# Altium project OPG_control_unit.PrjPcb
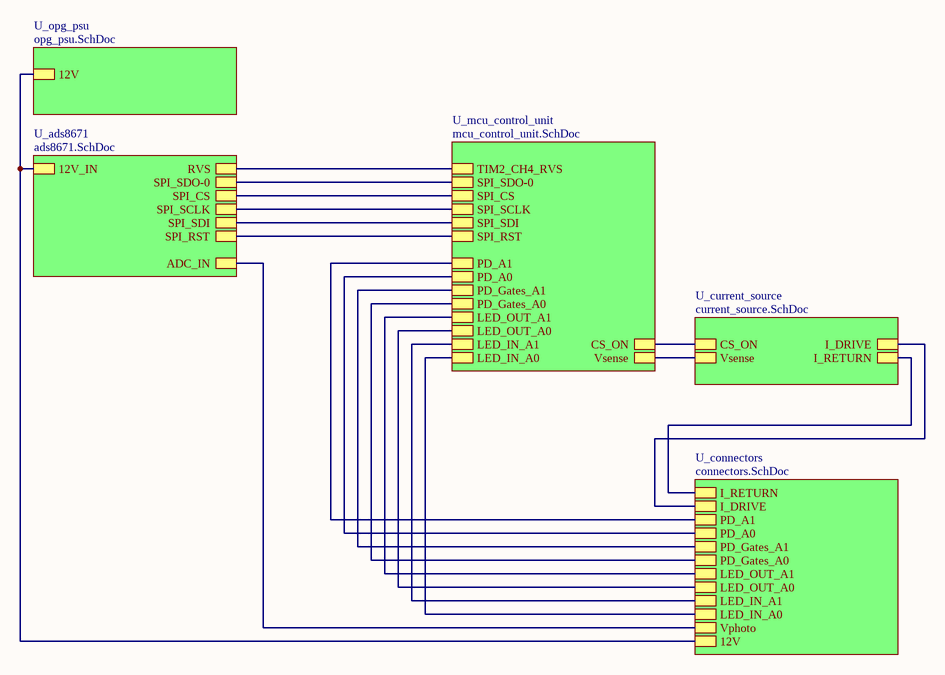
[diagram p0: top_sheet.SchDoc]
5 sheets, 67 parts. Net scope: hierarchical (ports join the sheet entries above them; power ports are global).
Board file: opg_control_unit_pcb.PcbDoc
Sheets:
  top_sheet.SchDoc
    U_current_source = current_source.SchDoc
    U_opg_psu = opg_psu.SchDoc
    U_connectors = connectors.SchDoc
    U_mcu_control_unit = mcu_control_unit.SchDoc

## Sheet top_sheet.SchDoc
size A4; SheetNumber: 1; SheetTotal: 6

### Sub-sheets
U_ads8671 = ads8671.SchDoc (file not in this document): SPI_SDO-0, SPI_SCLK, SPI_CS, SPI_SDI, SPI_RST, 12V_IN, RVS, ADC_IN
U_connectors = connectors.SchDoc: I_RETURN, I_DRIVE, PD_A1, PD_Gates_A1, PD_Gates_A0, LED_OUT_A1, LED_OUT_A0, LED_IN_A1, LED_IN_A0, PD_A0, 12V, Vphoto
U_current_source = current_source.SchDoc: I_DRIVE, I_RETURN, CS_ON, Vsense
U_mcu_control_unit = mcu_control_unit.SchDoc: SPI_SDO-0, SPI_CS, SPI_SCLK, SPI_SDI, SPI_RST, CS_ON, PD_A1, PD_A0, PD_Gates_A1, PD_Gates_A0, LED_OUT_A1, LED_OUT_A0, LED_IN_A1, LED_IN_A0, Vsense, TIM2_CH4_RVS
U_opg_psu = opg_psu.SchDoc: 12V

### Nets
FB: sheet U_current_source/I_RETURN, sheet U_connectors/I_RETURN
NRST: sheet U_ads8671/SPI_RST, sheet U_mcu_control_unit/SPI_RST
NetCSdiv_top_1: sheet U_current_source/CS_ON, sheet U_mcu_control_unit/CS_ON
NetJ2_1: sheet U_ads8671/ADC_IN, sheet U_connectors/Vphoto
NetJ2_3: sheet U_ads8671/12V_IN, sheet U_opg_psu/12V, sheet U_connectors/12V
NetJ2_4: sheet U_connectors/PD_A1, sheet U_mcu_control_unit/PD_A1
NetJ2_5: sheet U_connectors/PD_A0, sheet U_mcu_control_unit/PD_A0
NetJ2_6: sheet U_connectors/PD_Gates_A1, sheet U_mcu_control_unit/PD_Gates_A1
NetJ2_7: sheet U_connectors/PD_Gates_A0, sheet U_mcu_control_unit/PD_Gates_A0
NetJ2_8: sheet U_connectors/LED_OUT_A1, sheet U_mcu_control_unit/LED_OUT_A1
NetJ2_9: sheet U_connectors/LED_OUT_A0, sheet U_mcu_control_unit/LED_OUT_A0
NetJ2_10: sheet U_connectors/LED_IN_A1, sheet U_mcu_control_unit/LED_IN_A1
NetJ2_11: sheet U_connectors/LED_IN_A0, sheet U_mcu_control_unit/LED_IN_A0
NetJ2_13: sheet U_current_source/I_DRIVE, sheet U_connectors/I_DRIVE
NetSEN_1: sheet U_current_source/Vsense, sheet U_mcu_control_unit/Vsense
NetU1_13: sheet U_ads8671/RVS, sheet U_mcu_control_unit/TIM2_CH4_RVS
NetU1_14: sheet U_ads8671/SPI_CS, sheet U_mcu_control_unit/SPI_CS
NetU1_15: sheet U_ads8671/SPI_SCLK, sheet U_mcu_control_unit/SPI_SCLK
NetU1_16: sheet U_ads8671/SPI_SDO-0, sheet U_mcu_control_unit/SPI_SDO-0
NetU1_17: sheet U_ads8671/SPI_SDI, sheet U_mcu_control_unit/SPI_SDI

## Sheet current_source.SchDoc
size A4; SheetNumber: 3; SheetTotal: 6
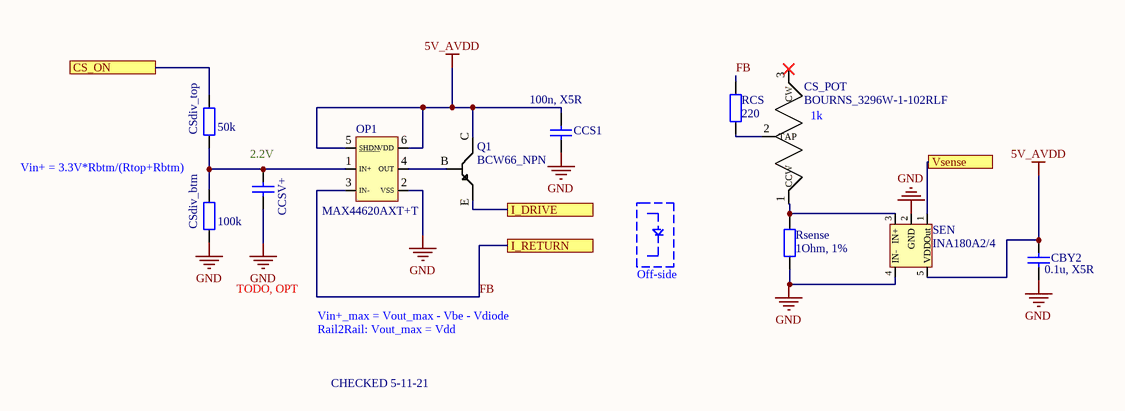
[diagram p1: current_source.SchDoc]

### Parts
CBY2  value 0.1u, X5R  [1608[0603]]
CCS1  value 100n, X5R  [1608[0603]]
CCSV+  value TODO, OPT  [1608[0603]]
CS_POT  BOURNS_3296W-1-102RLF  [BOURNS_3296W-1]
CSdiv_btm  100k  [WRIS-KSKE_0805]
CSdiv_top  50k  [WRIS-KSKE_0805]
OP1  MAX44620AXT+T  [MAX44260_ATX+T]
Q1  BCW66_NPN  [BCW66_NPN]
RCS  220  [WRIS-KSKE_0805]
Rsense  1Ohm, 1%  [WRIS-KSKE_0603]
SEN  INA180A2/4  [INA180Ax]

### Ports
CS_ON, I_DRIVE, I_RETURN, Vsense

### Nets
5V_AVDD: CBY2.1 CCS1.2 OP1.5(SHDN) OP1.6(VDD) Q1.C SEN.5(VDD)
GND: CBY2.2 CCS1.1 CCSV+.2 CSdiv_btm.2 OP1.2(VSS) Rsense.1 SEN.2(GND) SEN.4(IN-)
FB: OP1.3(IN-) RCS.1 ; port I_RETURN
NetCCSV+_1: CCSV+.1 CSdiv_btm.1 CSdiv_top.2 OP1.1(IN+)
NetCS_POT_1: CS_POT.1(CCW) Rsense.2 SEN.3(IN+)
NetCS_POT_2: CS_POT.2(TAP) RCS.2
NetCSdiv_top_1: CSdiv_top.1 ; port CS_ON
NetJ2_13: Q1.E ; port I_DRIVE
NetOP1_4: OP1.4(OUT) Q1.B
NetSEN_1: SEN.1(Out) ; port Vsense

Not connected (* = marked no-connect by the designer): CS_POT 3(CW)*

### Notes on the sheet
- Vin+ = 3.3V*Rbtm/(Rtop+Rbtm)
- (near CCSV+) 2.2V
- (near CS_POT) 1k
- Off-side
- Vin+_max = Vout_max - Vbe - Vdiode
- Rail2Rail: Vout_max = Vdd
- CHECKED 5-11-21

### Library data of the parts
CBY2 CCS1 CCSV+ = Cap Semi: Capacitor (Semiconductor SIM Model); Published: 8-Jun-2000; LatestRevisionDate: 29-May-2009; LatestRevisionNote: IPC-7351 Footprint Added.; PackageReference: C1206; Publisher: Altium Limited; PackageDescription: Chip Capacitor
CS_POT = BOURNS_3296W-1-104RLF: Vertical Potentiometer, multi-turn, 10%
CSdiv_btm CSdiv_top RCS = 560050320001: WRIS-KSKE SMT Thick Film Resistor, size 0805, 0.1Ohm, 0.33W; Manufacturer: Wurth Elektronik; Rated Current: 1.81A; Temperature Coefficient of Resistance: 250ppm/degC; Technical Reference: KE0805R100F103LAATP0000; Resistance Tolerance: +/-1%; ComponentLink1Description: Manufacturer; ComponentLink1URL: http://www.we-online.de; ComponentLink2Description: Datasheet; ComponentLink2URL: https://www.we-online.com/catalog/datasheet/560050320001.pdf; Published Date: May 2020; Rated Power: 0.33W; Resistance: 0.1Ohm; Height: 0.6mm; Operating Temperature: -55 to +155degC; Mounting Technology: SMT; Packaging: Tape and Reel; Size: 0805; Length: 2mm; Manufacturer Part Number: 560050320001; Width: 1.25mm
OP1 = MAX44620AXT+T: Operationsverstärker 1.8V, 15MHz Low-Offs et, Low-Power, Rail
Rsense = 560050316001: WRIS-KSKE SMT Thick Film Resistor, size 0603, 0.1Ohm, 0.25W; Manufacturer: Wurth Elektronik; Rated Current: 1.58A; Temperature Coefficient of Resistance: 250ppm/degC; Technical Reference: KE0603R100F104LAATP0000; Resistance Tolerance: +/-1%; ComponentLink1Description: Manufacturer; ComponentLink1URL: http://www.we-online.de; ComponentLink2Description: Datasheet; ComponentLink2URL: https://www.we-online.com/catalog/datasheet/560050316001.pdf; Published Date: May 2020; Rated Power: 0.25W; Resistance: 0.1Ohm; Height: 0.45mm; Operating Temperature: -55 to +155degC; Mounting Technology: SMT; Packaging: Tape and Reel; Size: 0603; Length: 1.6mm; Manufacturer Part Number: 560050316001; Width: 0.8mm
SEN = INA180Ax: INA180Ax Low- and High-SideVoltageOutput,Current-SenseAmplifiers

## Sheet opg_psu.SchDoc
size A4; SheetNumber: 4; SheetTotal: 6
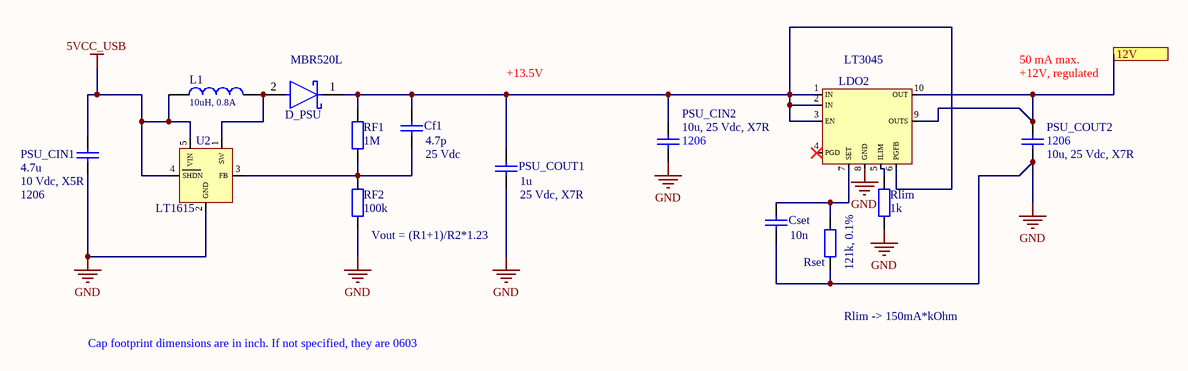
[diagram p2: opg_psu.SchDoc]

### Parts
Cf1  value 4.7p  [1608[0603]]
Cset  value 10n  [1608[0603]]
D_PSU  MBR0540T1G  [On_Semiconductor_425-04_MFG]  (value not drawn)
L1  10uH, 0.8A  [WE-PD2_3521]
LDO2  LT3045  [LT3045]
PSU_CIN1  value 4.7u  [C1206]
PSU_CIN2  value 10u, 25 Vdc, X7R  [C1206]
PSU_COUT1  value 1u  [1608[0603]]
PSU_COUT2  value 10u, 25 Vdc, X7R  [C1206]
RF1  1M  [WRIS-KSKE_0805]
RF2  100k  [WRIS-KSKE_0805]
Rlim  1k  [WRIS-KSKE_0805]
Rset  121k, 0.1%  [WRIS-KSKE_1206]
U2  LT1615  [LT1615]

### Ports
12V

### Nets
5VCC_USB: L1.1 PSU_CIN1.2 U2.4(SHDN) U2.5(VIN)
GND: Cset.1 LDO2.8(GND) PSU_CIN1.1 PSU_CIN2.1 PSU_COUT1.1 PSU_COUT2.1 RF2.1 Rlim.1 Rset.1 U2.2(GND)
NetCf1_1: Cf1.1 RF1.1 RF2.2 U2.3(FB)
NetCf1_2: Cf1.2 D_PSU.1(C) LDO2.1(IN) LDO2.2(IN) LDO2.3(EN) LDO2.6(PGFB) PSU_CIN2.2 PSU_COUT1.2 RF1.2
NetCset_2: Cset.2 LDO2.7(SET) Rset.2
NetD_PSU_2: D_PSU.2(A) L1.2 U2.1(SW)
NetJ2_3: LDO2.9(OUTS) LDO2.10(OUT) PSU_COUT2.2 ; port 12V
NetLDO2_5: LDO2.5(ILIM) Rlim.2

Not connected (* = marked no-connect by the designer): LDO2 4(PGD)*

### Notes on the sheet
- (near D_PSU) MBR520L
- 50 mA max.
- +13.5V
- +12V, regulated
- (near PSU_CIN1) 10 Vdc, X5R
- (near PSU_CIN1) 1206
- (near Cf1) 25 Vdc
- (near PSU_COUT1) 25 Vdc, X7R
- (near PSU_CIN2) 1206
- (near PSU_COUT2) 1206
- (near RF2) Vout = (R1+1)/R2*1.23
- Rlim -> 150mA*kOhm
- Cap footprint dimensions are in inch. If not specified, they are 0603

### Library data of the parts
Cf1 Cset PSU_CIN1 PSU_CIN2 PSU_COUT1 PSU_COUT2 = Cap Semi: Capacitor (Semiconductor SIM Model); Published: 8-Jun-2000; LatestRevisionDate: 29-May-2009; LatestRevisionNote: IPC-7351 Footprint Added.; PackageReference: C1206; Publisher: Altium Limited; PackageDescription: Chip Capacitor
L1 = 7447732110: WE-PD2 SMT Power Inductor, size 3521, 10uH, 0.8A; Manufacturer: Wurth Elektronik; Self Resonant Frequency: 45MHz; DC Resistance max.: 0.3Ohm; DC Resistance typ.: 0.237Ohm; Saturation Current: 1.23A; ComponentLink1Description: Manufacturer; ComponentLink1URL: http://www.we-online.de; ComponentLink2Description: Datasheet; ComponentLink2URL: https://www.we-online.com/catalog/datasheet/7447732110.pdf; Packaging: Tape and Reel; Published Date: April 2020; Rated Current: 0.8A; Operating Temperature: -40 to +125degC; Size: 3521; Inductance: 10uH; Mounting Technology: SMT; Manufacturer Part Number: 7447732110
LDO2 = LT3045: 20V, 500mA, Ultralow Noise, Ultrahigh PSRR LDO
RF1 RF2 Rlim = 560050320001: as CSdiv_btm on sheet current_source; ComponentLink1Description: Manufacturer; ComponentLink1URL: http://www.we-online.de; ComponentLink2Description: Datasheet; ComponentLink2URL: https://www.we-online.com/catalog/datasheet/560050320001.pdf; Published Date: May 2020; Rated Power: 0.33W; Resistance: 0.1Ohm; Height: 0.6mm; Operating Temperature: -55 to +155degC; Mounting Technology: SMT; Packaging: Tape and Reel; Size: 0805; Length: 2mm; Manufacturer Part Number: 560050320001; Width: 1.25mm
Rset = 560050332001: WRIS-KSKE SMT Thick Film Resistor, size 1206, 0.05Ohm, 0.5W; Manufacturer: Wurth Elektronik; Rated Current: 3.16A; Temperature Coefficient of Resistance: 250ppm/degC; Technical Reference: KE1206R050F102LAATP0000; Resistance Tolerance: +/-1%; ComponentLink1Description: Manufacturer; ComponentLink1URL: http://www.we-online.de; ComponentLink2Description: Datasheet; ComponentLink2URL: https://www.we-online.com/catalog/datasheet/560050332001.pdf; Published Date: May 2020; Rated Power: 0.5W; Resistance: 0.05Ohm; Height: 0.6mm; Operating Temperature: -55 to +155degC; Mounting Technology: SMT; Packaging: Tape and Reel; Size: 1206; Length: 3.1mm; Manufacturer Part Number: 560050332001; Width: 1.6mm
U2 = LT1615: Micropower Step-up DC/DC Converter in ThinSOT

## Sheet connectors.SchDoc
size A4; SheetNumber: 6; SheetTotal: 6
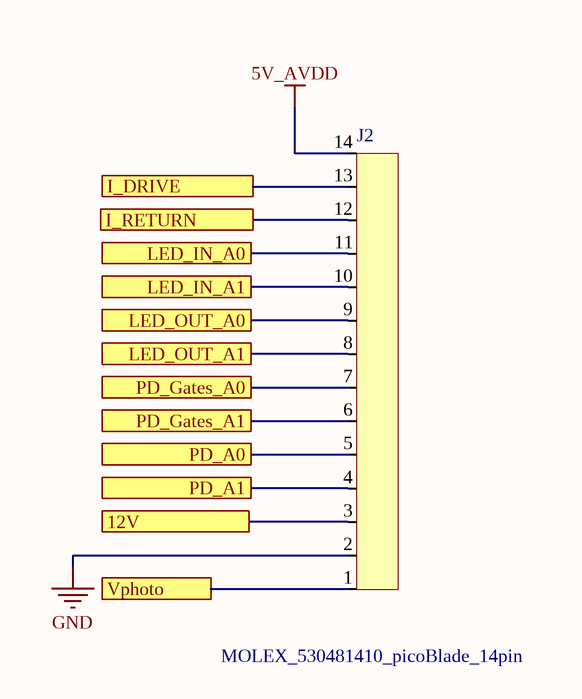
[diagram p3: connectors.SchDoc]

### Parts
J2  MOLEX_530481410_picoBlade_14pin  [MOLEX_530481410_picoBlade_14pin]

### Ports
12V, I_DRIVE, I_RETURN, LED_IN_A0, LED_IN_A1, LED_OUT_A0, LED_OUT_A1, PD_A0, PD_A1, PD_Gates_A0, PD_Gates_A1, Vphoto

### Nets
5V_AVDD: J2.14
GND: J2.2
FB: J2.12 ; port I_RETURN
NetJ2_1: J2.1 ; port Vphoto
NetJ2_3: J2.3 ; port 12V
NetJ2_4: J2.4 ; port PD_A1
NetJ2_5: J2.5 ; port PD_A0
NetJ2_6: J2.6 ; port PD_Gates_A1
NetJ2_7: J2.7 ; port PD_Gates_A0
NetJ2_8: J2.8 ; port LED_OUT_A1
NetJ2_9: J2.9 ; port LED_OUT_A0
NetJ2_10: J2.10 ; port LED_IN_A1
NetJ2_11: J2.11 ; port LED_IN_A0
NetJ2_13: J2.13 ; port I_DRIVE

## Sheet mcu_control_unit.SchDoc
size A4; SheetNumber: 2; SheetTotal: 6
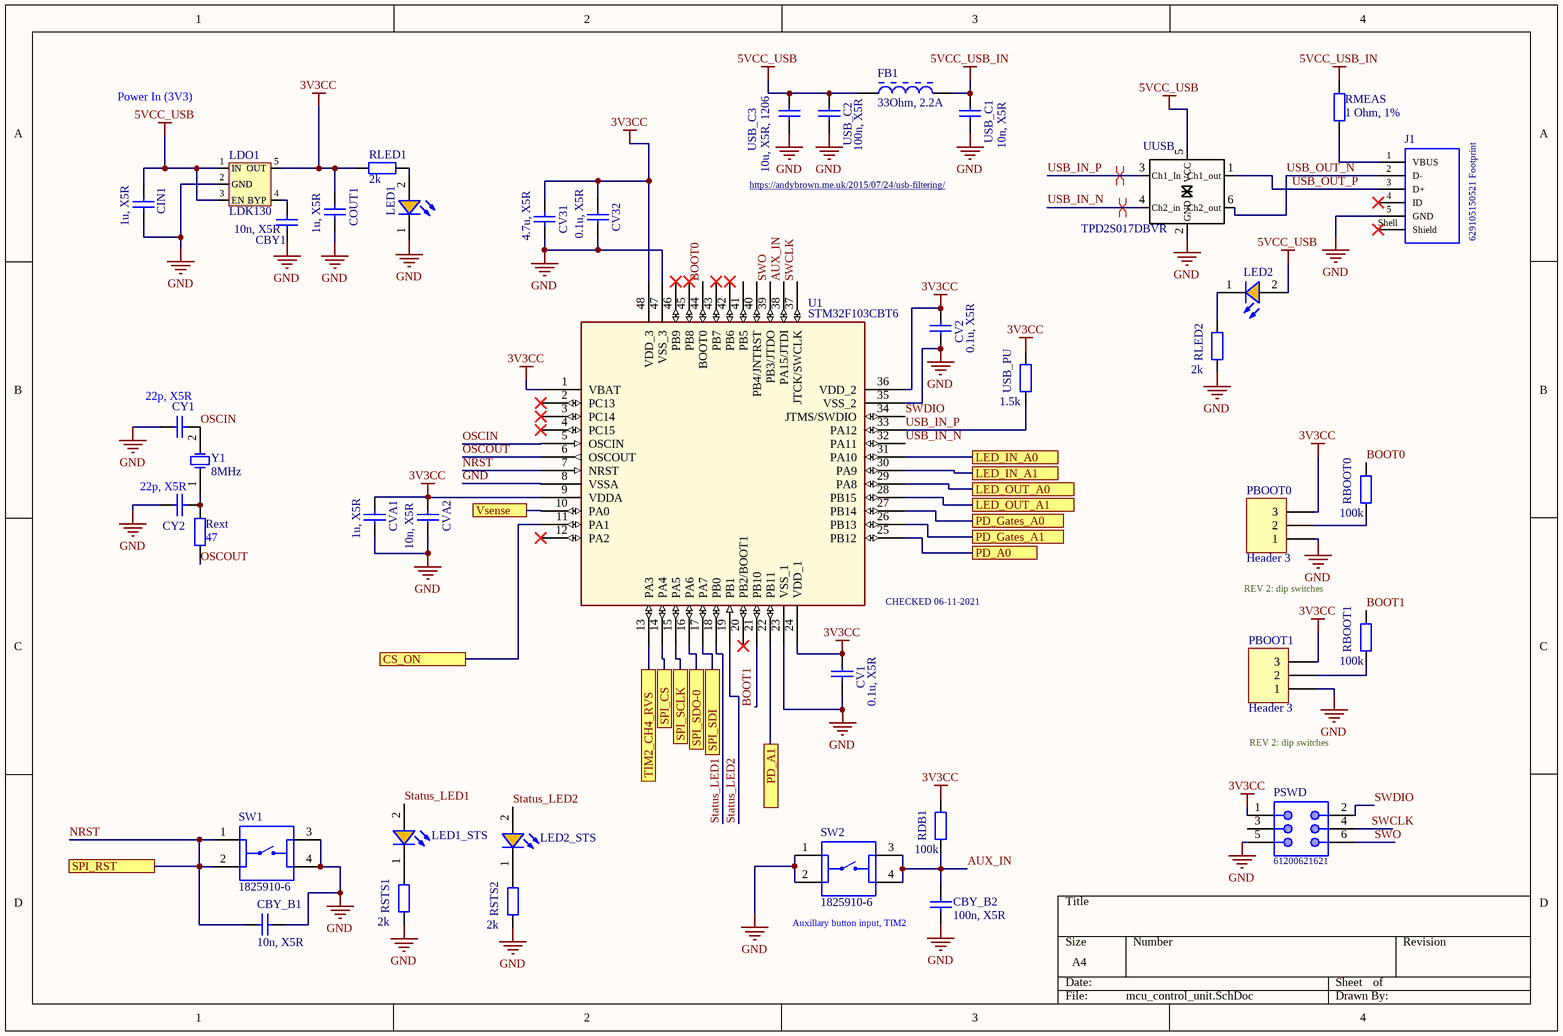
[diagram p4: mcu_control_unit.SchDoc]

### Parts
CBY1  value 10n, X5R  [1608[0603]]
CBY_B1  value 10n, X5R  [1608[0603]]
CBY_B2  value 100n, X5R  [1608[0603]]
CIN1  value 1u, X5R  [1608[0603]]
COUT1  value 1u, X5R  [1608[0603]]
CV1  value 0.1u, X5R  [0402]
CV2  value 0.1u, X5R  [0402]
CV31  value 4.7u, X5R  [1608[0603]]
CV32  value 0.1u, X5R  [0402]
CVA1  value 1u, X5R  [0402]
CVA2  value 10n, X5R  [0402]
CY1  value 22p, X5R  [1608[0603]]
CY2  value 22p, X5R  [1608[0603]]
FB1  33Ohm, 2.2A  [WE-CBF_0603_High Speed]
J1  629105150521 Footprint  [629105150921]
LDO1  LDK130  [LDK130]
LED1  (no value)  [WL-SMCW_0603_H=0.7mm]
LED1_STS  (no value)  [WL-SMCW_0603_H=0.7mm]
LED2  (no value)  [WL-SMCW_0603_H=0.7mm]
LED2_STS  (no value)  [WL-SMCW_0603_H=0.7mm]
PBOOT0  Header 3  [HDR1X3]
PBOOT1  Header 3  [HDR1X3]
PSWD  61200621621  [61200621621]
RBOOT0  100k  [WRIS-KSKE_0805]
RBOOT1  100k  [WRIS-KSKE_0805]
RDB1  100k  [WRIS-KSKE_0805]
Rext  47  [WRIS-KSKE_0805]
RLED1  2k  [WRIS-KSKE_0805]
RLED2  2k  [WRIS-KSKE_0805]
RMEAS  1 Ohm, 1%  [WRIS-KSKE_0603]
RSTS1  2k  [WRIS-KSKE_0805]
RSTS2  2k  [WRIS-KSKE_0805]
SW1  1825910-6  [SW_1825910-6-4]
SW2  1825910-6  [SW_1825910-6-4]
U1  STM32F103CBT6  [LQFP48_0R5_7x7]
USB_C1  value 10n, X5R  [1608[0603]]
USB_C2  value 100n, X5R  [1608[0603]]
USB_C3  value 10u, X5R, 1206  [C1206]
USB_PU  1.5k  [WRIS-KSKE_0805]
UUSB  TPD2S017DBVR  [TPD2S017DBVR]
Y1  8MHz  [WE-XTAL_HC49/4HSMX]

### Ports
CS_ON, LED_IN_A0, LED_IN_A1, LED_OUT_A0, LED_OUT_A1, PD_A0, PD_A1, PD_Gates_A0, PD_Gates_A1, SPI_CS, SPI_RST, SPI_SCLK, SPI_SDI, SPI_SDO-0, TIM2_CH4_RVS, Vsense

### Nets
3V3CC: COUT1.2 CV1.2 CV2.2 CV31.2 CV32.2 CVA1.2 CVA2.2 LDO1.5(OUT) PBOOT0.3 PBOOT1.3 PSWD.1 RDB1.2 RLED1.1 U1.1(VBAT) U1.9(VDDA) U1.24(VDD_1) U1.36(VDD_2) U1.48(VDD_3) USB_PU.2
5VCC_USB: CIN1.2 FB1.1 LDO1.1(IN) LDO1.3(EN) LED2.2(A) USB_C2.2 USB_C3.2 UUSB.5(VCC)
5VCC_USB_IN: FB1.2 RMEAS.2 USB_C1.2
GND: CBY1.1 CBY_B1.1 CBY_B2.2 CIN1.1 COUT1.1 CV1.1 CV2.1 CV31.1 CV32.1 CVA1.1 CVA2.1 CY1.2 CY2.2 J1.5(GND) LDO1.2(GND) LED1.1(K) PBOOT0.1 PBOOT1.1 PSWD.5 RLED2.1 RSTS1.1 RSTS2.1 SW1.3 SW1.4 SW2.1 SW2.2 U1.8(VSSA) U1.23(VSS_1) U1.35(VSS_2) U1.47(VSS_3) USB_C1.1 USB_C2.1 USB_C3.1 UUSB.2(GND)
AUX_IN: CBY_B2.1 RDB1.1 SW2.3 SW2.4 U1.38(PA15/JTDI)
BOOT0: RBOOT0.2 U1.44(BOOT0)
BOOT1: RBOOT1.2 U1.21(PB10)
NRST: CBY_B1.2 SW1.1 SW1.2 U1.7(NRST) ; port SPI_RST
OSCIN: CY1.1 U1.5(OSCIN) Y1.2(OSC2)
OSCOUT: Rext.1 U1.6(OSCOUT)
Status_LED1: LED1_STS.2(A) U1.18(PB0)
Status_LED2: LED2_STS.2(A) U1.19(PB1)
SWCLK: PSWD.4 U1.37(JTCK/SWCLK)
SWDIO: PSWD.2 U1.34(JTMS/SWDIO)
SWO: PSWD.6 U1.39(PB3/JTDO)
USB_IN_N: U1.32(PA11) UUSB.4(Ch2_in)
USB_IN_P: U1.33(PA12) USB_PU.1 UUSB.3(Ch1_In)
USB_OUT_N: J1.2(D-) UUSB.6(Ch2_out)
USB_OUT_P: J1.3(D+) UUSB.1(Ch1_out)
NetCBY1_2: CBY1.2 LDO1.4(BYP)
NetCSdiv_top_1: U1.11(PA1) ; port CS_ON
NetCY2_1: CY2.1 Rext.2 Y1.1(OSC1)
NetJ1_1: J1.1(VBUS) RMEAS.1
NetJ2_4: U1.22(PB11) ; port PD_A1
NetJ2_5: U1.25(PB12) ; port PD_A0
NetJ2_6: U1.26(PB13) ; port PD_Gates_A1
NetJ2_7: U1.27(PB14) ; port PD_Gates_A0
NetJ2_8: U1.28(PB15) ; port LED_OUT_A1
NetJ2_9: U1.29(PA8) ; port LED_OUT_A0
NetJ2_10: U1.30(PA9) ; port LED_IN_A1
NetJ2_11: U1.31(PA10) ; port LED_IN_A0
NetLED1_2: LED1.2(A) RLED1.2
NetLED1_STS_1: LED1_STS.1(K) RSTS1.2
NetLED2_1: LED2.1(K) RLED2.2
NetLED2_STS_1: LED2_STS.1(K) RSTS2.2
NetPBOOT0_2: PBOOT0.2 RBOOT0.1
NetPBOOT1_2: PBOOT1.2 RBOOT1.1
NetSEN_1: U1.10(PA0) ; port Vsense
NetU1_13: U1.13(PA3) ; port TIM2_CH4_RVS
NetU1_14: U1.14(PA4) ; port SPI_CS
NetU1_15: U1.15(PA5) ; port SPI_SCLK
NetU1_16: U1.16(PA6) ; port SPI_SDO-0
NetU1_17: U1.17(PA7) ; port SPI_SDI

Not connected (* = marked no-connect by the designer): J1 4(ID)* Shell(Shield)*; PSWD 3; U1 2(PC13)* 3(PC14)* 4(PC15)* 12(PA2)* 20(PB2/BOOT1)* 40(PB4/JNTRST) 41(PB5) 42(PB6)* 43(PB7)* 45(PB8)* 46(PB9)*

### Layout directives
differential pair: USB_IN_N, USB_IN_P

### Notes on the sheet
- Power In (3V3)
- https://andybrown.me.uk/2015/07/24/usb-filtering/
- (near U1) CHECKED 06-11-2021
- REV 2: dip switches
- (near CBY_B2) Auxillary button input, TIM2

### Library data of the parts
CBY1 CBY_B1 CBY_B2 CIN1 COUT1 CV1 CV2 CV31 CV32 CVA1 CVA2 CY1 CY2 USB_C1-USB_C3 = Cap Semi: Capacitor (Semiconductor SIM Model); Published: 8-Jun-2000; LatestRevisionDate: 29-May-2009; LatestRevisionNote: IPC-7351 Footprint Added.; PackageReference: C1206; Publisher: Altium Limited; PackageDescription: Chip Capacitor
FB1 = 742792605: WE-CBF SMT EMI Suppression Ferrite Bead, size 0603, 33Ohm, 2.2A; Manufacturer: Wurth Elektronik; Impedance max.: 50Ohm; DC Resistance max.: 0.1Ohm; Type: High Speed; ComponentLink1Description: Manufacturer; ComponentLink1URL: http://www.we-online.de; ComponentLink2Description: Datasheet; ComponentLink2URL: https://www.we-online.com/catalog/datasheet/742792605.pdf; Operating Temperature: -55 to +125degC; Packaging: Tape and Reel; Published Date: March 2020; Rated Current: 2.2A; Manufacturer Part Number: 742792605; Impedance @100MHz: 33Ohm; Mounting Technology: SMT; Size: 0603
J1 = 629105150921: Micro USB 2.0 Type AB, Receptacle, Horizontal, SMT; Manufacturer: Wurth Elektronik; Rated Current: 1.8A; Pin Number: 5; Interface Type: Type AB; Working Voltage: 30VAC; ComponentLink1Description: Manufacturer; ComponentLink1URL: http://www.we-online.de; ComponentLink2Description: Datasheet; ComponentLink2URL: https://katalog.we-online.com/em/datasheet/629105150921.pdf; Published Date: August 2020; Manufacturer Part Number: 629105150921; Gender: Receptacle; Type: Horizontal; Packaging: Tape and Reel; Operating Temperature: -40 to +85degC; Mounting Technology: SMT; Application: Micro USB 2.0
LDO1 = LDK130: 300 mA low quiescent current very low noise LDO
LED1 LED1_STS LED2 LED2_STS = 150060AS75000: WL-SMCW SMT Mono-color Chip LED Waterclear, size 0603, Amber, 2V, 140deg; Chip Technology: AlInGaP; Dominant Wavelength typ.: 605nm; Luminous Intensity typ.: 130mcd; Peak Wavelength typ.: 610nm; Viewing Angle: 140deg; ComponentLink1Description: Manufacturer; ComponentLink1URL: http://www.we-online.de; ComponentLink2URL: https://www.we-online.com/catalog/datasheet/150060AS75000.pdf; ComponentLink2Description: Datasheet; Forward Voltage typ.: 2V; Emitting Color: Amber; Mounting Technology: SMT; Operating Temperature: -40 to +85degC; Published Date: December 2019; Part Number: 150060AS75000; Packaging: Tape and Reel; Size: 0603; Publisher: Wurth Elektronik
PBOOT0 PBOOT1 = Header 3: Header, 3-Pin; LatestRevisionDate: 17-Jul-2002; LatestRevisionNote: Re-released for DXP Platform.; Publisher: Altium Limited
PSWD = 61200621621: Male Box Header WR-BHD, THT, Vertical, pitch 2.54 mm, 6 pins; Pitch: 2.54 mm; Working Voltage: 250 VAC; Withstanding Voltage: 500 VAC; Contact Resistance: 20 mOhm; Pin Number: 6; ComponentLink1Description: Manufacturer; ComponentLink1URL: http://www.we-online.de; ComponentLink2Description: Datasheet; ComponentLink2URL: https://katalog.we-online.de/em/datasheet/6120xx21621.pdf; Part Number: 61200621621; Published Date: August 2018; Publisher: Wurth Elektronik; Operating Temperature: -40 to 125 degC; Packaging: Tray; Gender: Male; Mounting Technology: THT; Orientation: Vertical
RBOOT0 RBOOT1 RDB1 Rext RLED1 RLED2 RSTS1 RSTS2 USB_PU = 560050320001: as CSdiv_btm on sheet current_source; ComponentLink1Description: Manufacturer; ComponentLink1URL: http://www.we-online.de; ComponentLink2Description: Datasheet; ComponentLink2URL: https://www.we-online.com/catalog/datasheet/560050320001.pdf; Published Date: May 2020; Rated Power: 0.33W; Resistance: 0.1Ohm; Height: 0.6mm; Operating Temperature: -55 to +155degC; Mounting Technology: SMT; Packaging: Tape and Reel; Size: 0805; Length: 2mm; Manufacturer Part Number: 560050320001; Width: 1.25mm
RMEAS = 560050316011: WRIS-KSKE SMT Thick Film Resistor, size 0603, 0.5Ohm, 0.25W; Manufacturer: Wurth Elektronik; Rated Current: 0.7A; Temperature Coefficient of Resistance: +/-100ppm/degC; Technical Reference: KE0603R500F104KAATP0000; Resistance Tolerance: +/-1%; ComponentLink1Description: Manufacturer; ComponentLink1URL: http://www.we-online.de; ComponentLink2Description: Datasheet; ComponentLink2URL: https://www.we-online.com/catalog/datasheet/560050316011.pdf; Published Date: May 2020; Rated Power: 0.25W; Resistance: 0.5Ohm; Height: 0.45mm; Operating Temperature: -55 to +155degC; Mounting Technology: SMT; Packaging: Tape and Reel; Size: 0603; Length: 1.6mm; Manufacturer Part Number: 560050316011; Width: 0.8mm
SW1 SW2 = 1825910-6: Switch Push Button OFF _ON_ SPST Round Button 0.05A 24VDC Momentary Contact PC Pins Thru-Hole; Configuration_Pole-Throw: Single Pole - Single Throw; MF: TE Connectivity; Contact_Current_Rating: 50 mA; Digi-Key_Purchase_URL: https://www.digikey.com/product-detail/en/te-connectivity-alcoswitch-switches/1825910-6/450-1650-ND/1632536?utm_source=snapeda&utm_medium=aggregator&utm_campaign=symbol; TE_purchase_URL: https://www.te.com/usa-en/product-1825910-6.html?te_bu=Cor&te_type=disp&te_campaign=seda_glo_cor-seda-global-disp-prtnr-fy19-seda-model-bom-cta_sma-317_1&elqCampaignId=32493; Value: *; Digi-Key_Part_Number: 450-1650-ND; SnapEDA_Link: https://www.snapeda.com/parts/1825910-6/TE%20Connectivity%20ALCOSWITCH%20Switches/view-part/424522/?ref=snap; EU_RoHS_Compliance: Compliant; MP: 1825910-6; Package: None
U1 = STM32F103CBT6: Medium-density performance line ARM-based 32-bit MCU with 64KB Flash; Manuf_Part_1: STM32F103C8T6; Manuf_1: STM; Ref St: 9175981; Provided: ST; ECCN_US/EU: 3A991A2/NEC; Footprint: QFP48 7X7; Distrib: ST; Order: STM32F103C8T6
UUSB = TPD2S017DBVR: 2-Channel Ultra-Low Clamp Voltage ESD / Solution With Series-Resistor Isolation
Y1 = 830003151: WE-XTAL Quartz Crystal, SMT, HC49/4HSMX, 8MHz, +/-30ppm; Manufacturer: Wurth Elektronik; Frequency Stability: +/-50ppm; Load Capacitance: 16pF; ComponentLink1Description: Manufacturer; ComponentLink1URL: http://www.we-online.de; ComponentLink2Description: Datasheet; ComponentLink2URL: https://katalog.we-online.com/pbs/datasheet/830003151.pdf; Operating Temperature: -10 to +60degC; Packaging: Tape and Reel; Manufacturer Part Number: 830003151; Published Date: July 2020; Size: HC49/4HSMX; Frequency: 8MHz; Frequency Tolerance: +/-30ppm; Mounting Technology: SMT

## Nets that join several sheets
5V_AVDD: current_source (6 pins), connectors (J2.14)
5VCC_USB: opg_psu (L1.1 PSU_CIN1.2 U2.4 U2.5), mcu_control_unit (8 pins)
GND: current_source (8 pins), opg_psu (10 pins), connectors (J2.2), mcu_control_unit (34 pins)
FB: current_source (OP1.3 RCS.1), connectors (J2.12)
NetCSdiv_top_1: current_source (CSdiv_top.1), mcu_control_unit (U1.11)
NetJ2_3: opg_psu (LDO2.9 LDO2.10 PSU_COUT2.2), connectors (J2.3)
NetJ2_4: connectors (J2.4), mcu_control_unit (U1.22)
NetJ2_5: connectors (J2.5), mcu_control_unit (U1.25)
NetJ2_6: connectors (J2.6), mcu_control_unit (U1.26)
NetJ2_7: connectors (J2.7), mcu_control_unit (U1.27)
NetJ2_8: connectors (J2.8), mcu_control_unit (U1.28)
NetJ2_9: connectors (J2.9), mcu_control_unit (U1.29)
NetJ2_10: connectors (J2.10), mcu_control_unit (U1.30)
NetJ2_11: connectors (J2.11), mcu_control_unit (U1.31)
NetJ2_13: current_source (Q1.E), connectors (J2.13)
NetSEN_1: current_source (SEN.1), mcu_control_unit (U1.10)